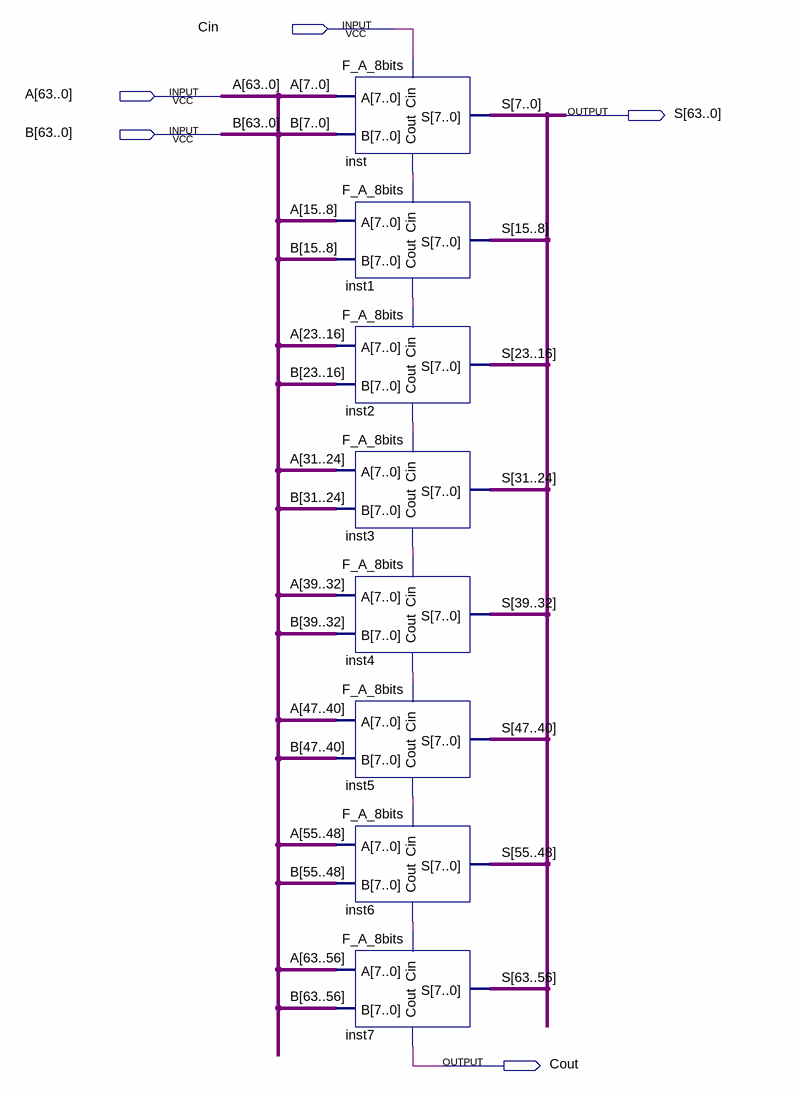
[diagram p0: schematic sheet]
// Quartus schematic F_A_64bits.bdf as structural Verilog: 8 symbols, 5 pins
module F_A_64bits (
  input  Cin,
  input  [63:0] A,
  input  [63:0] B,
  output [63:0] S,
  output Cout
);

  wire inst1_cout, inst2_cout, inst3_cout, inst4_cout, inst5_cout, inst6_cout, inst_cout;

  F_A_8bits inst (.Cin(Cin), .A(A[7:0]), .B(B[7:0]), .S(S[7:0]), .Cout(inst_cout));
  F_A_8bits inst1 (.Cin(inst_cout), .A(A[15:8]), .B(B[15:8]), .S(S[15:8]), .Cout(inst1_cout));
  F_A_8bits inst2 (.Cin(inst1_cout), .A(A[23:16]), .B(B[23:16]), .S(S[23:16]), .Cout(inst2_cout));
  F_A_8bits inst3 (.Cin(inst2_cout), .A(A[31:24]), .B(B[31:24]), .S(S[31:24]), .Cout(inst3_cout));
  F_A_8bits inst4 (.Cin(inst3_cout), .A(A[39:32]), .B(B[39:32]), .S(S[39:32]), .Cout(inst4_cout));
  F_A_8bits inst5 (.Cin(inst4_cout), .A(A[47:40]), .B(B[47:40]), .S(S[47:40]), .Cout(inst5_cout));
  F_A_8bits inst6 (.Cin(inst5_cout), .A(A[55:48]), .B(B[55:48]), .S(S[55:48]), .Cout(inst6_cout));
  F_A_8bits inst7 (.Cin(inst6_cout), .A(A[63:56]), .B(B[63:56]), .S(S[63:56]), .Cout(Cout));
endmodule
